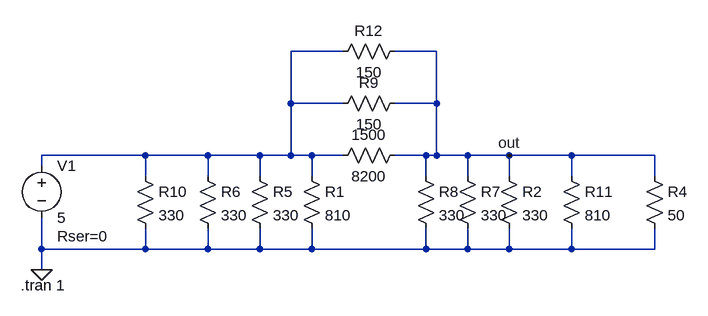
[diagram p0: schematic Atten10dB.asc]
Atten10dB.asc, the LTspice schematic file:
Version 4
SHEET 1 880 680
WIRE 192 -112 112 -112
WIRE 336 -112 272 -112
WIRE 112 -32 112 -112
WIRE 192 -32 112 -32
WIRE 336 -32 336 -112
WIRE 336 -32 272 -32
WIRE -112 48 -272 48
WIRE -16 48 -112 48
WIRE 64 48 -16 48
WIRE 112 48 112 -32
WIRE 112 48 64 48
WIRE 144 48 112 48
WIRE 192 48 144 48
WIRE 320 48 272 48
WIRE 336 48 336 -32
WIRE 336 48 320 48
WIRE 384 48 336 48
WIRE 448 48 384 48
WIRE 544 48 448 48
WIRE 672 48 544 48
WIRE -272 64 -272 48
WIRE -112 80 -112 48
WIRE -16 80 -16 48
WIRE 64 80 64 48
WIRE 144 80 144 48
WIRE 320 80 320 48
WIRE 384 80 384 48
WIRE 448 80 448 48
WIRE 544 80 544 48
WIRE 672 80 672 48
WIRE -272 192 -272 144
WIRE -112 192 -112 160
WIRE -112 192 -272 192
WIRE -16 192 -16 160
WIRE -16 192 -112 192
WIRE 64 192 64 160
WIRE 64 192 -16 192
WIRE 144 192 144 160
WIRE 144 192 64 192
WIRE 320 192 320 160
WIRE 320 192 144 192
WIRE 384 192 384 160
WIRE 384 192 320 192
WIRE 448 192 448 160
WIRE 448 192 384 192
WIRE 544 192 544 160
WIRE 544 192 448 192
WIRE 672 192 672 160
WIRE 672 192 544 192
WIRE -272 224 -272 192
FLAG -272 224 0
FLAG 448 48 out
SYMBOL res 128 64 R0
SYMATTR InstName R1
SYMATTR Value 810
SYMBOL res 432 64 R0
SYMATTR InstName R2
SYMATTR Value 330
SYMBOL res 288 32 R90
WINDOW 0 0 56 VBottom 2
WINDOW 3 32 56 VTop 2
SYMATTR InstName 1500
SYMATTR Value 8200
SYMBOL voltage -272 48 R0
WINDOW 123 0 0 Left 0
WINDOW 39 24 124 Left 2
SYMATTR SpiceLine Rser=0
SYMATTR InstName V1
SYMATTR Value 5
SYMBOL res 656 64 R0
SYMATTR InstName R4
SYMATTR Value 50
SYMBOL res 48 64 R0
SYMATTR InstName R5
SYMATTR Value 330
SYMBOL res -32 64 R0
SYMATTR InstName R6
SYMATTR Value 330
SYMBOL res 368 64 R0
SYMATTR InstName R7
SYMATTR Value 330
SYMBOL res 304 64 R0
SYMATTR InstName R8
SYMATTR Value 330
SYMBOL res 288 -48 R90
WINDOW 0 0 56 VBottom 2
WINDOW 3 32 56 VTop 2
SYMATTR InstName R9
SYMATTR Value 150
SYMBOL res -128 64 R0
SYMATTR InstName R10
SYMATTR Value 330
SYMBOL res 528 64 R0
SYMATTR InstName R11
SYMATTR Value 810
SYMBOL res 288 -128 R90
WINDOW 0 0 56 VBottom 2
WINDOW 3 32 56 VTop 2
SYMATTR InstName R12
SYMATTR Value 150
TEXT -304 248 Left 2 !.tran 1

The netlist it stands for:
* Atten10dB.asc
R1 N001 0 810
R2 out 0 330
R§1500 out N001 8200
V1 N001 0 5 Rser=0
R4 out 0 50
R5 N001 0 330
R6 N001 0 330
R7 out 0 330
R8 out 0 330
R9 out N001 150
R10 N001 0 330
R11 out 0 810
R12 out N001 150
.tran 1
.backanno
.end

* Results of the author's LTspice run, read from the files saved beside the schematic
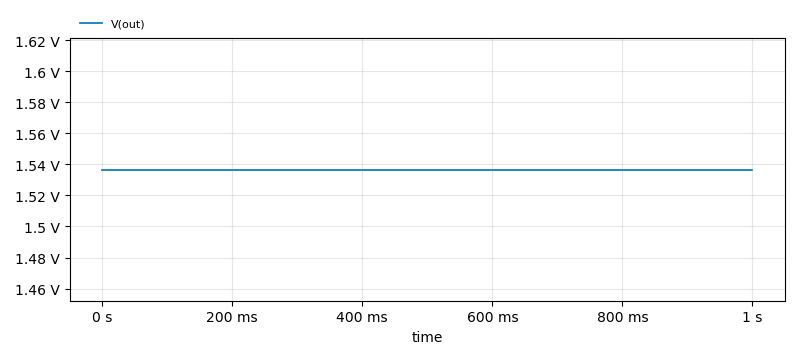
[diagram p1: Transient Analysis of Atten10dB.asc, plotted from the saved traces]
* Transient Analysis, 1 run:
*   V(out): min 1.537 V, max 1.537 V, average 1.537 V, rms 1.537 V, last 1.537 V